# Altium schematic sheet SPI_Flash.SchDoc: SPI Flash
size A4
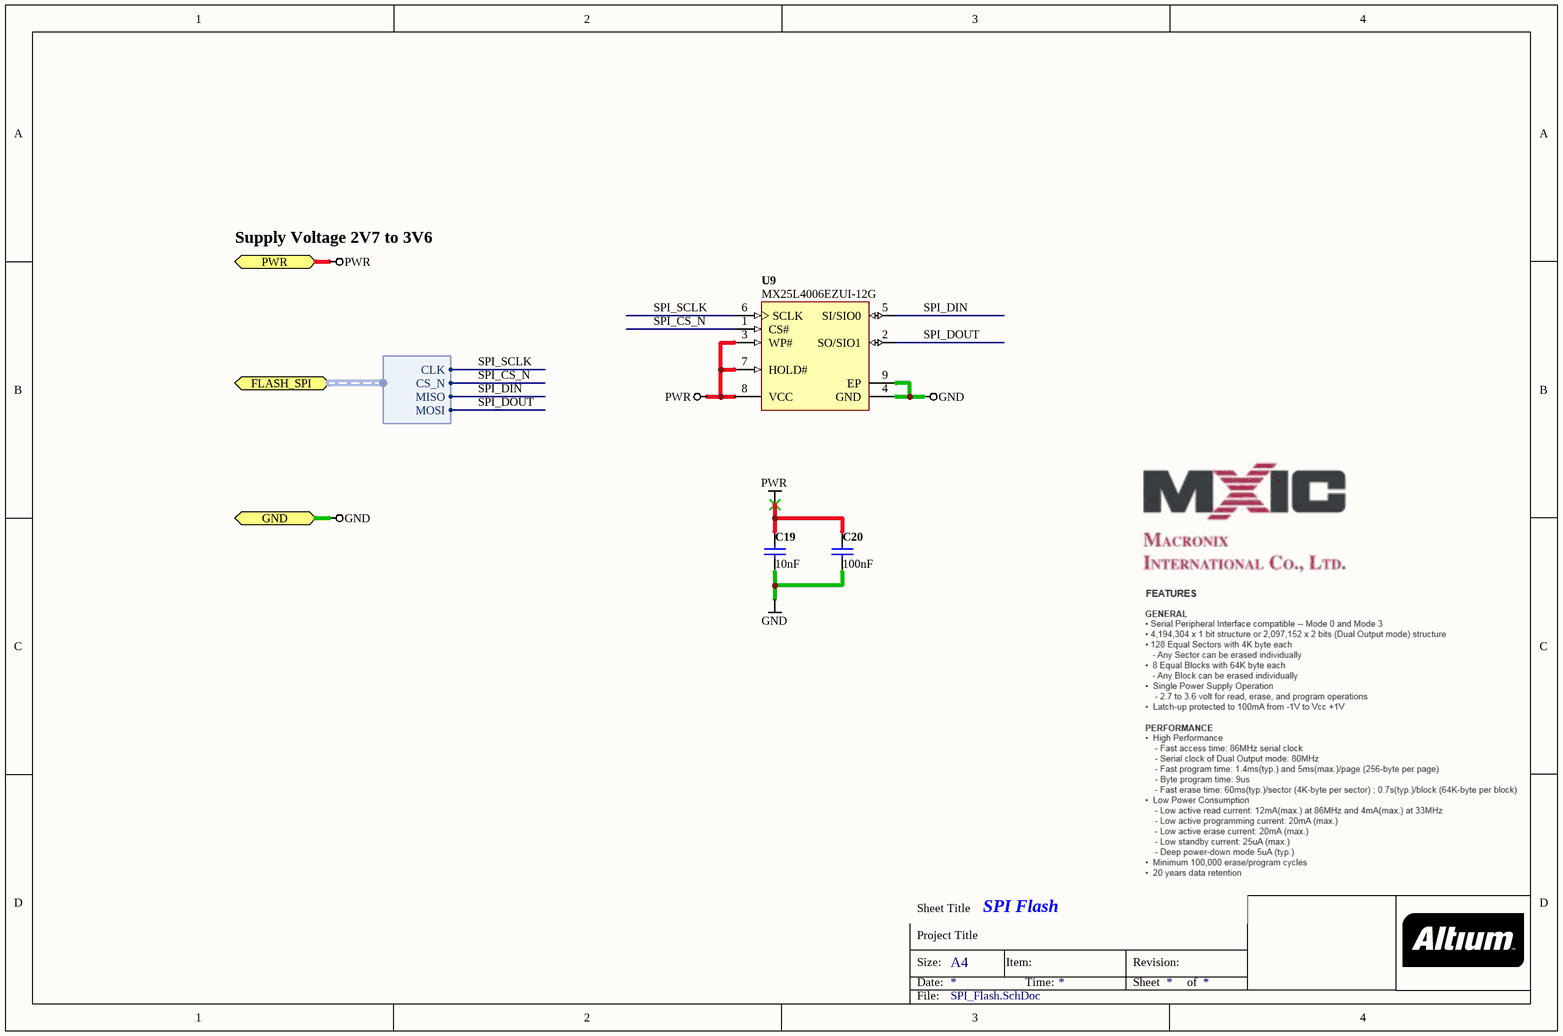
[diagram p0: SPI_Flash.SchDoc]

## Parts
C19  value 10nF  [CAPC0402(1005)60_N]  (hidden comment: CAP 10nF 6.3V 0402(1005))
C20  value 100nF  [CAPC0402(1005)60_N]  (hidden comment: CAP 100nF 6.3V 0402(1005))
U9  MX25L4006EZUI-12G  [MXIC-USON-8_V]

## Ports
FLASH_SPI (harness FLASH_SPI), GND, PWR

## Harnesses
FLASH_SPI: CLK, MOSI, MISO, CS_N

## Nets
GND: C19.2 C20.1 U9.4(GND) U9.9(EP) ; port GND
PWR: C19.1 C20.2 U9.3(WP#) U9.7(HOLD#) U9.8(VCC) ; port PWR
SPI_CS_N: U9.1(CS#) ; port FLASH_SPI.CS_N
SPI_DIN: U9.5(SI/SIO0) ; port FLASH_SPI.MISO
SPI_DOUT: U9.2(SO/SIO1) ; port FLASH_SPI.MOSI
SPI_SCLK: U9.6(SCLK) ; port FLASH_SPI.CLK

## Notes on the sheet
- Supply Voltage 2V7 to 3V6
- Sheet Title
- Project Title
- Size:
- Date:
- A4
- Item:
- Time:
- Revision:
- Sheet
- of
- File:

## Library data of the parts
C19 = CMP-1034-01869-1: CAP 10nF 6.3V ?0% 0402 (1005 Metric) Thickness 0.6mm SMD; Case-EIA: 0402; Case-Metric: 1005; Rated Voltage: 6.3 V; Tolerance: ?0%; Max Thickness: 0.6 mm; Technology: SMT
C20 = CMP-1034-02062-1: CAP 100nF 6.3V ?0% 0402 (1005 Metric) Thickness 0.6mm SMD; Case-EIA: 0402; Case-Metric: 1005; Rated Voltage: 6.3 V; Max Thickness: 0.6 mm; Tolerance: ?0%; Technology: SMT
U9 = CMP-0467-00001-1: 4 M-Bit [x1 / x2] CMOS Serial Flash, 86 MHz, -0.7 to 3.6 V, -40 to 85 degC, Body 2 x 3 x 0.6 mm; Manufacturer: Macronix; Standby Current(uA): 10; Vin: -2.7 to 3.6 V; Density: 4Mb; Frequency(MHz): 86; Bus Width: x1,x2; Sector Type: 4KB,64KB; Operating Current(mA): 12; Operating Tempertaure: -40 to 85 degC; DatasheetVersion: Rev. 1.3; ComponentLink3URL: http://www.macronix.com/QuickPlace/hq/PageLibrary4825740B00298A3B.nsf/h_Index/3F21BAC2E121E17848257639003A3146/$File/MX25L4006E,%203V,%204Mb,%20v1.3.pdf; PackageReference: USON-8; ComponentLink1URL: http://www.macronix.com; Mounting Technology: Surface Mount; ComponentLink2URL: http://www.macronix.com/QuickPlace/hq/PageLibrary4825740B00298A3B.nsf/h_Index/3F21BAC2E121E17848257639003A3146/$File/MX25L4006E,%203V,%204Mb,%20v1.3.pdf; ComponentLink3Description: Package Specification; PackageDescription: 8-Pin Small Outline No-lead Package, Body 2 x 3mm, Pitch 0.5 mm; ComponentLink1Description: Manufacturer URL; ComponentLink2Description: Datasheet; PackageVersion: Rev. 3; PartNumber: MX25L4006EZUI-12G